# Altium schematic sheet IoT_Greenhouse V1.0 A - Rev His.SchDoc
size A4; Email: eliofagundez07@gmail.com; DrawnBy: ELIO F.; Engineer: ELIO F.; Revision: A; SheetNumber: 1; SheetTotal: 5; Sheet Title: Cover Page
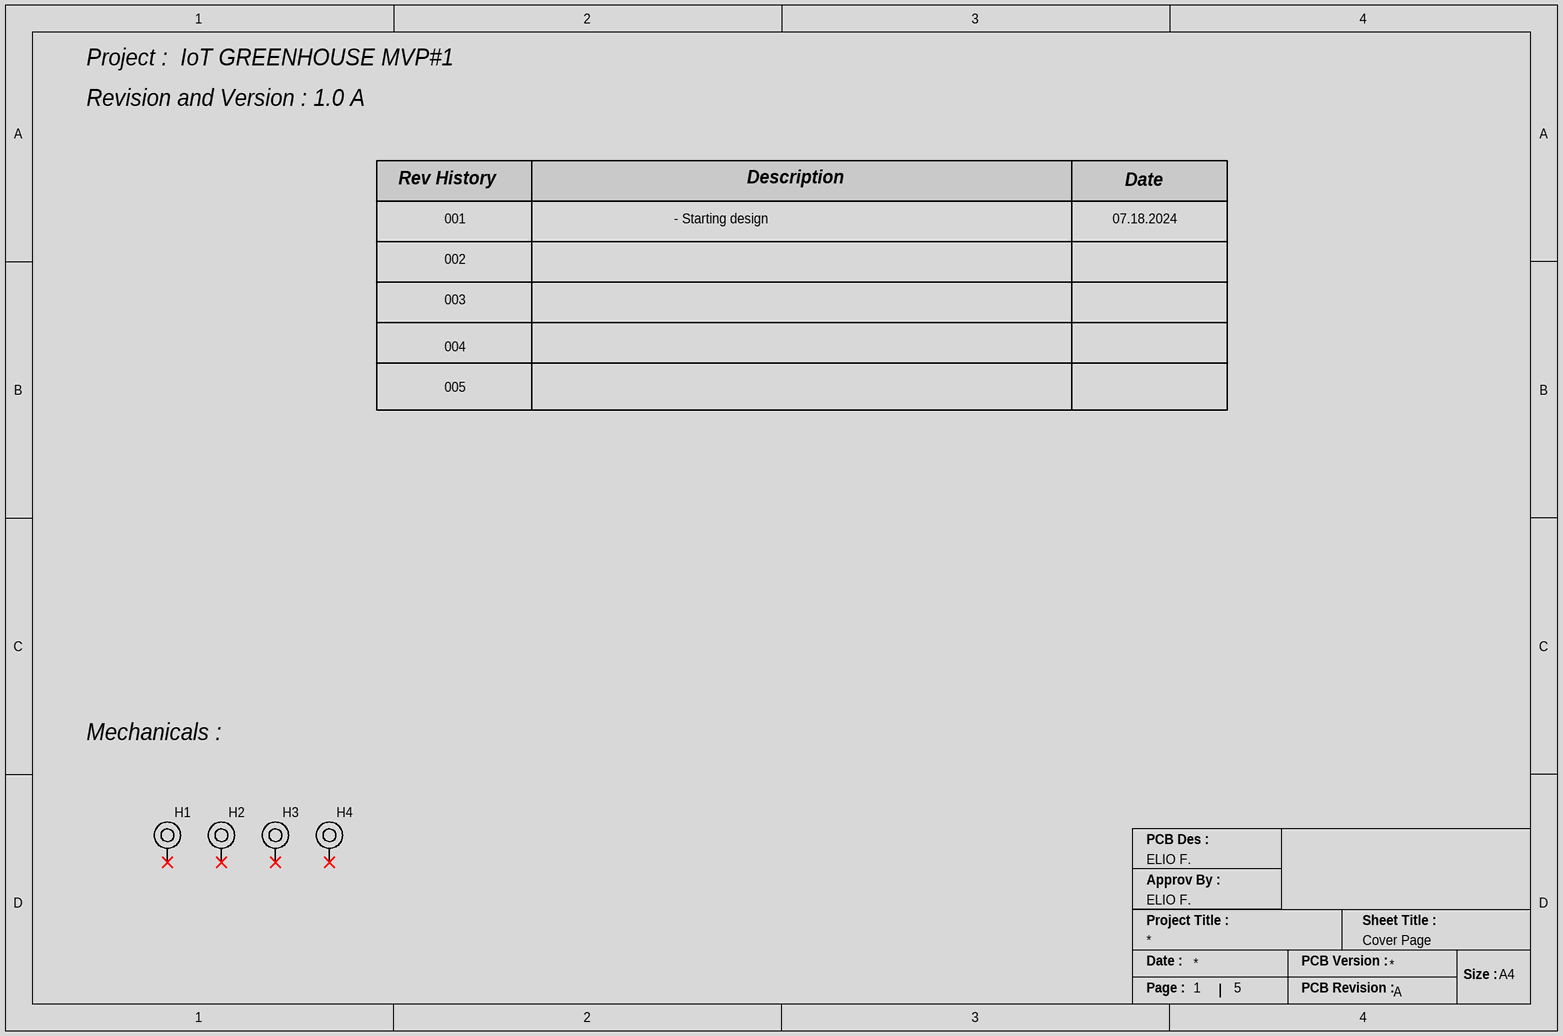
[diagram p0: IoT_Greenhouse V1.0 A - Rev His.SchDoc]

## Parts
H1  Mounting Hole  [PTH_3.2X5]  (value not drawn)  (no BOM)
H2  Mounting Hole  [PTH_3.2X5]  (value not drawn)  (no BOM)
H3  Mounting Hole  [PTH_3.2X5]  (value not drawn)  (no BOM)
H4  Mounting Hole  [PTH_3.2X5]  (value not drawn)  (no BOM)

## Nets

Not connected (* = marked no-connect by the designer): H1 1*; H2 1*; H3 1*; H4 1*

## Notes on the sheet
- Project :  IoT GREENHOUSE MVP#1
- Revision and Version : 1.0 A
- Rev History
- 001
- - Starting design
- Description
- 07.18.2024
- Date
- 002
- 003
- 004
- 005
- Mechanicals :
- PCB Des :
- Approv By :
- Project Title :
- Sheet Title :
- Date :
- PCB Version :
- Size :
- A4
- Page :
- PCB Revision :

## Library data of the parts
H1-H4 = MECHANICALS_MOUNT_PTH: Mounting Hole, Plated